# EasyEDA schematic SCH_Final_2025-04-04.json
TITLE: Sheet_1; REV: 1.0; Date: 2025-04-03; Sheet: 1/1; Company: Your Company
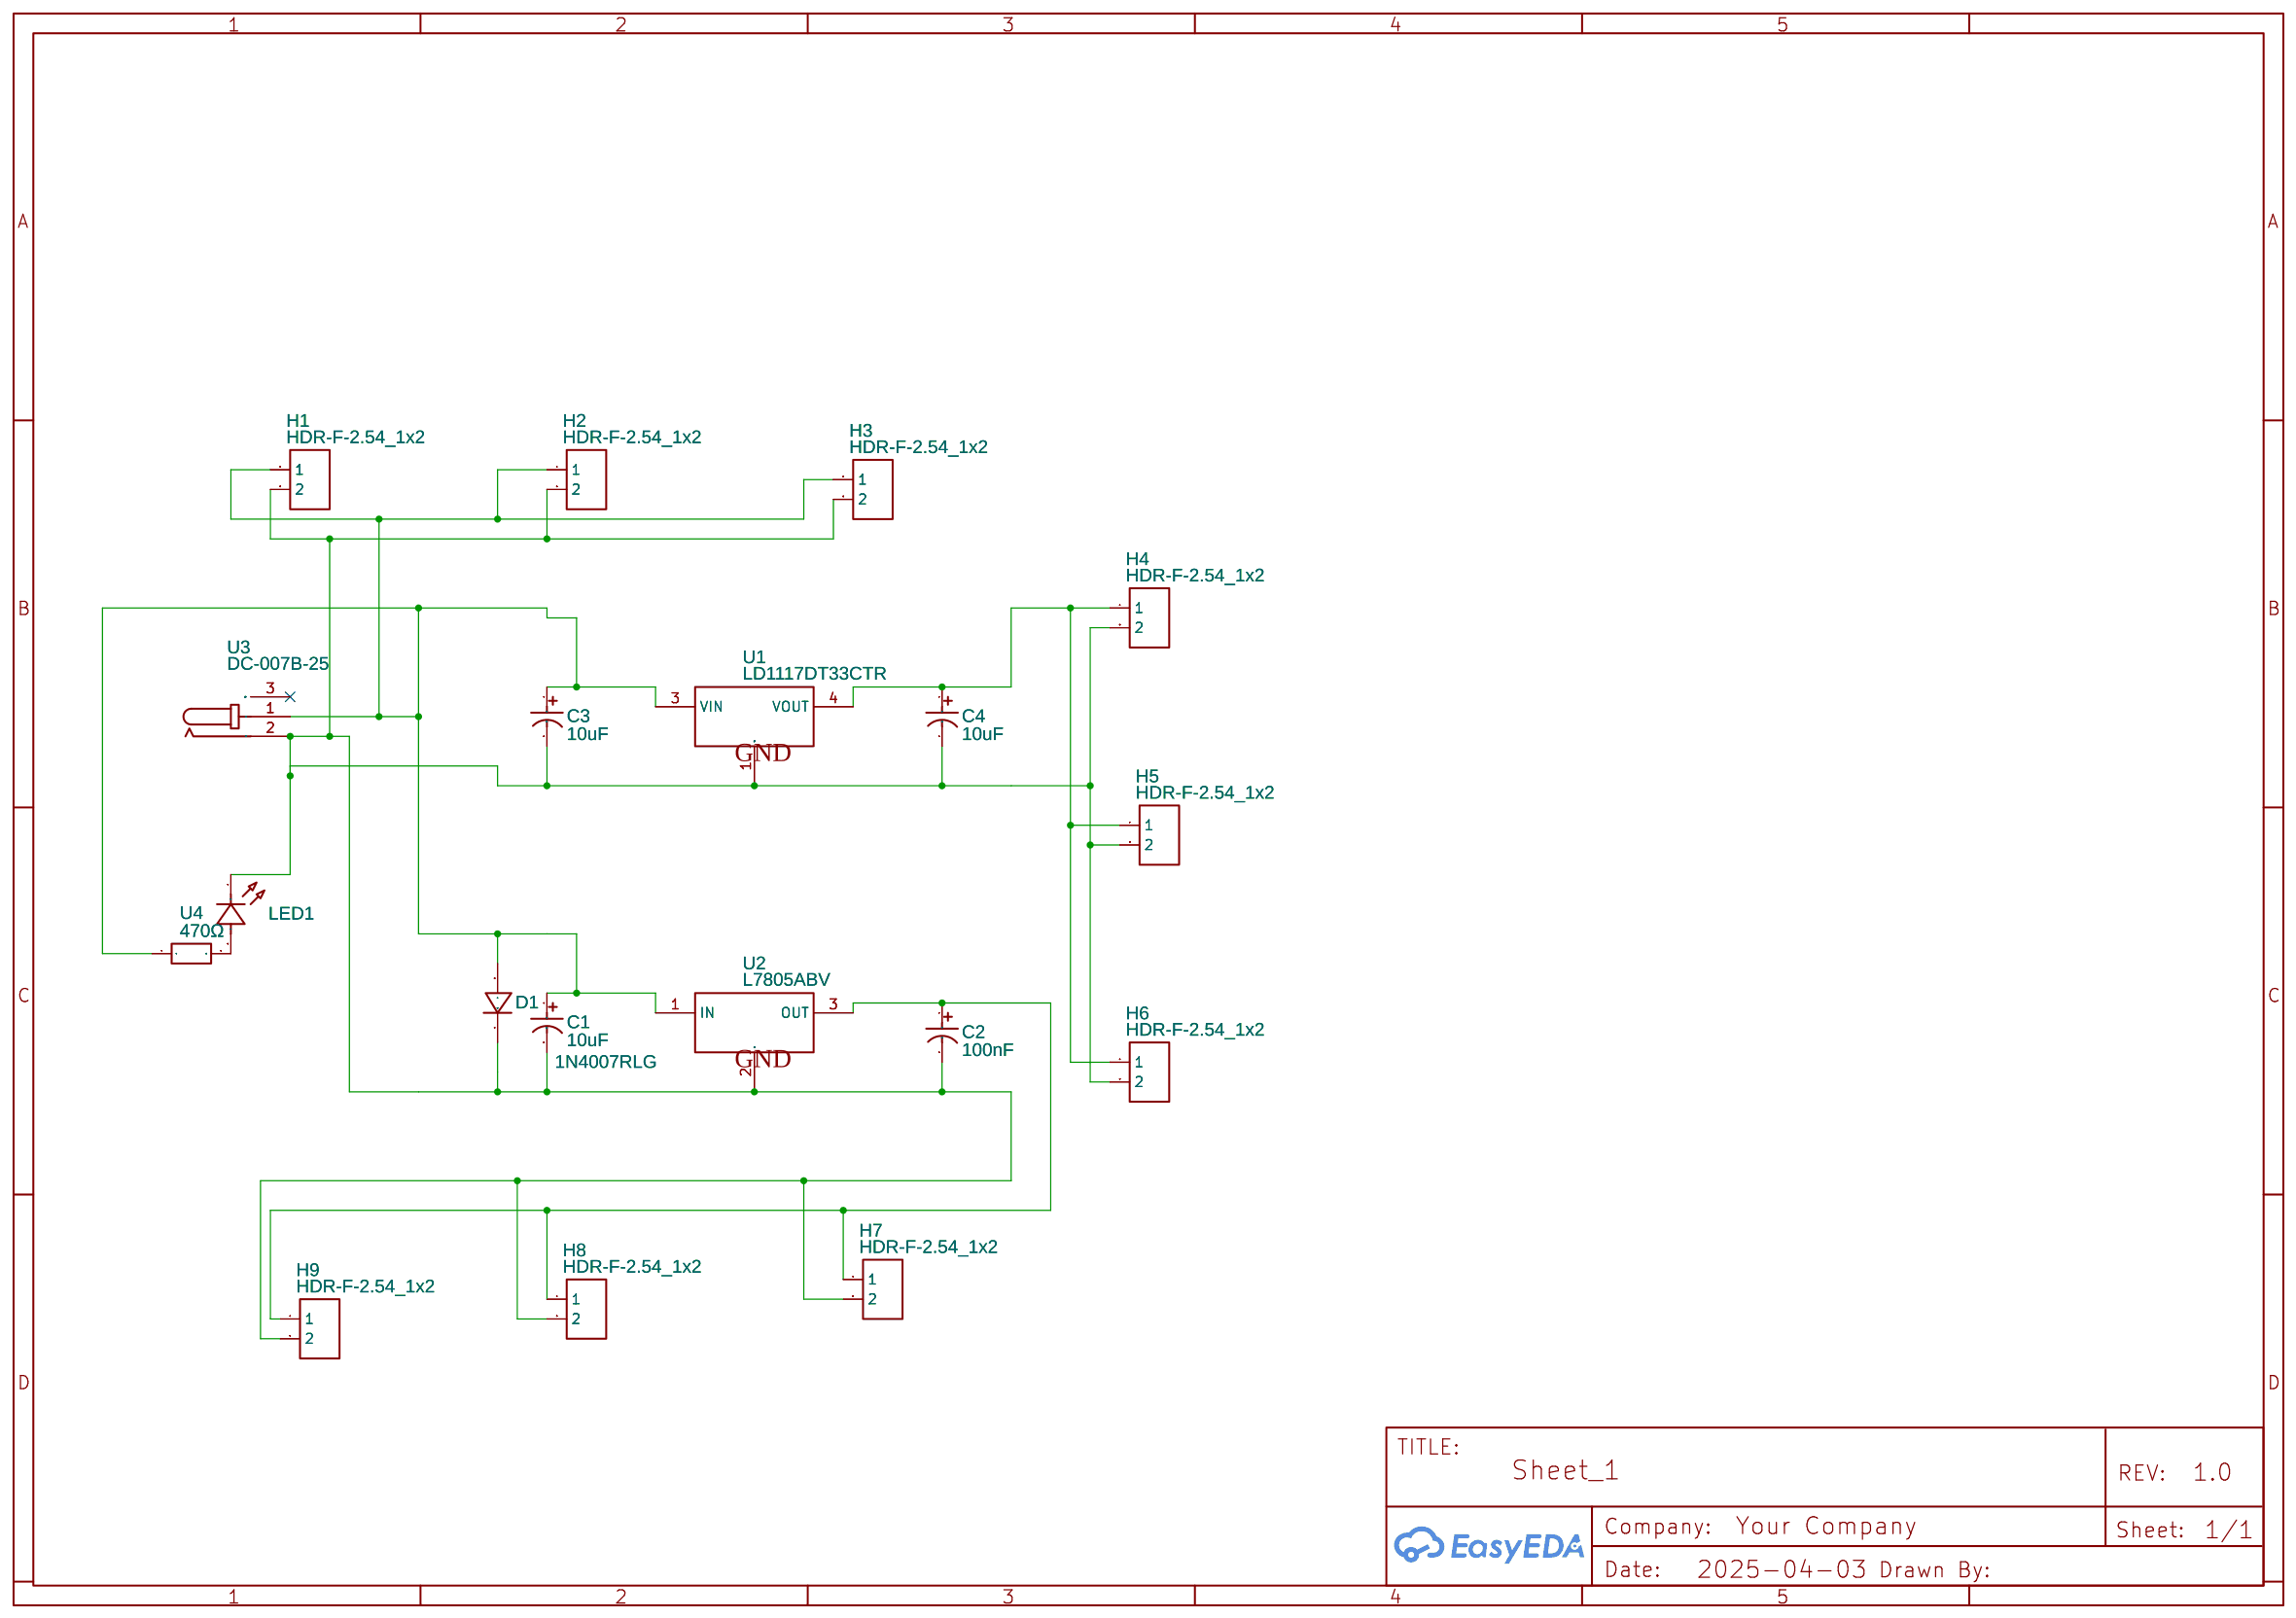
[diagram p0: schematic sheet]

## Parts
C1  10uF  [CAP-TH_BD4.0-P1.50-D0.8-FD]
C2  100nF  [CAP-TH_BD4.0-P1.50-D0.8-FD]
C3  10uF  [CAP-TH_BD4.0-P1.50-D0.8-FD]
C4  10uF  [CAP-TH_BD4.0-P1.50-D0.8-FD]
D1  1N4007RLG  [DO-41_BD2.4-L4.7-P8.70-D0.9-RD]
H1  HDR-F-2.54_1x2  [HDR-F-2.54_1X2]
H2  HDR-F-2.54_1x2  [HDR-F-2.54_1X2]
H3  HDR-F-2.54_1x2  [HDR-F-2.54_1X2]
H4  HDR-F-2.54_1x2  [HDR-F-2.54_1X2]
H5  HDR-F-2.54_1x2  [HDR-F-2.54_1X2]
H6  HDR-F-2.54_1x2  [HDR-F-2.54_1X2]
H7  HDR-F-2.54_1x2  [HDR-F-2.54_1X2]
H8  HDR-F-2.54_1x2  [HDR-F-2.54_1X2]
H9  HDR-F-2.54_1x2  [HDR-F-2.54_1X2]
LED1  F.0603.00013/P2-0603Y1TS2-06T-001  [LED0603-RD]
U1  LD1117DT33CTR  [TO-252-2_L6.5-W6.1-P4.58-LS10.0-TL]
U2  L7805ABV  [TO-220-3_L10.0-W4.5-P2.54-L]
U3  DC-007B-25  [DC-IN-TH_D21122000012-DCJACK]
U4  470Ω  [R0805]

## Library data of the parts
C1 C3 C4 = 10uF 25V 4*5: Supplier: LCSC; Manufacturer: CX(承兴); Manufacturer Part: KF106M025C05RR0VH2FP0; Supplier Part: C43846; JLCPCB Part Class: Extended Part
C2 = 0.1uF 50V 4*7: Supplier: LCSC; Manufacturer: CX(承兴); Manufacturer Part: KS104M050C07RR0VH2FP0; Supplier Part: C45664; JLCPCB Part Class: Extended Part
D1 = 1N4007RLG: Supplier: LCSC; Manufacturer: onsemi(安森美); Supplier Part: C53568
H1-H9 = HDR-F-2.54_1x2: Supplier Part: C49661; Supplier: LCSC; Contributor: LCEDA_Lib
LED1 = F.0603.00013/P2-0603Y1TS2-06T-001: Supplier: LCSC; Supplier Part: C7496811; Manufacturer: TUOZHAN(拓展光电); Contributor: lcsc; JLCPCB Part Class: Extended Part
U1 = LD1117DT33CTR: Supplier: LCSC; Manufacturer: ST(意法半导体); Supplier Part: C36395; JLCPCB Part Class: Extended Part
U2 = L7805ABV: Supplier: LCSC; Manufacturer: ST(意法半导体); Supplier Part: C16807
U3 = DC-007B-25: Supplier: LCSC; Supplier Part: C22435687; Manufacturer: HanElectricity(瀚源); Contributor: lcsc; JLCPCB Part Class: Extended Part
U4 = FRC0805J471 TS: Supplier: LCSC; Supplier Part: C2907329; Manufacturer: FOJAN(富捷); JLCPCB Part Class: Extended Part; Contributor: lcsc

## Nets
Net-(C1-1): C1.1 C3.1 D1.2(A) H1.1 H2.1 H3.1 U1.3(VIN) U2.1(IN) U3.1 U4.1
Net-(C1-2): C1.2 C2.2 C3.2 C4.2 D1.1(C) H1.2 H2.2 H3.2 H4.2 H5.2 H6.2 H7.2 H8.2 H9.2 LED1.1(K) U1.1(GND) U2.2(GND) U3.2
Net-(C2-1): C2.1 H7.1 H8.1 H9.1 U2.3(OUT)
Net-(C4-1): C4.1 H4.1 H5.1 H6.1 U1.4(VOUT)
Net-(LED1-2): LED1.2(A) U4.2

Not connected (* = marked no-connect by the designer): U3 3(SHELL)*
